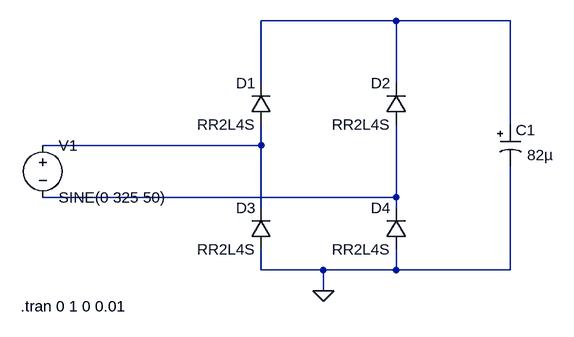
[diagram p0: schematic AC-DC.asc]
AC-DC.asc, the LTspice schematic file:
Version 4
SHEET 1 880 680
WIRE 496 -144 288 -144
WIRE 672 -144 496 -144
WIRE 288 -48 288 -144
WIRE 496 -48 496 -144
WIRE 672 16 672 -144
WIRE 288 48 288 16
WIRE 288 48 -48 48
WIRE 496 128 496 16
WIRE 496 128 -48 128
WIRE 288 144 288 48
WIRE 496 144 496 128
WIRE 288 240 288 208
WIRE 384 240 288 240
WIRE 496 240 496 208
WIRE 496 240 384 240
WIRE 672 240 672 80
WIRE 672 240 496 240
WIRE 384 272 384 240
FLAG 384 272 0
SYMBOL voltage -48 32 R0
WINDOW 39 0 0 Left 0
SYMATTR InstName V1
SYMATTR Value SINE(0 325 50)
SYMATTR Value2 AC 0 0
SYMBOL diode 304 16 R180
WINDOW 0 24 64 Left 2
WINDOW 3 24 0 Left 2
SYMATTR InstName D1
SYMATTR Value RR2L4S
SYMBOL diode 512 16 R180
WINDOW 0 24 64 Left 2
WINDOW 3 24 0 Left 2
SYMATTR InstName D2
SYMATTR Value RR2L4S
SYMBOL diode 304 208 R180
WINDOW 0 24 64 Left 2
WINDOW 3 24 0 Left 2
SYMATTR InstName D3
SYMATTR Value RR2L4S
SYMBOL diode 512 208 R180
WINDOW 0 24 64 Left 2
WINDOW 3 24 0 Left 2
SYMATTR InstName D4
SYMATTR Value RR2L4S
SYMBOL polcap 656 16 R0
WINDOW 3 42 47 Left 2
SYMATTR InstName C1
SYMATTR Value 82µ
SYMATTR Description Capacitor
SYMATTR Type cap
SYMATTR SpiceLine V=400 Irms=470m Rser=0.440713 Lser=12.6725n mfg="Würth Elektronik" pn="860021381019 WCAP-ATG5 18x25" type="Al electrolytic"
TEXT -82 296 Left 2 !.tran 0 1 0 0.01

The netlist it stands for:
* AC-DC.asc
V1 N002 N003 SINE(0 325 50) AC 0 0
D1 N002 N001 RR2L4S
D2 N003 N001 RR2L4S
D3 0 N002 RR2L4S
D4 0 N003 RR2L4S
C1 N001 0 82µ V=400 Irms=470m Rser=0.440713 Lser=12.6725n mfg="Würth Elektronik" pn="860021381019 WCAP-ATG5 18x25" type="Al electrolytic"
.model D D
.lib standard.dio
.tran 0 1 0 0.01
.backanno
.end